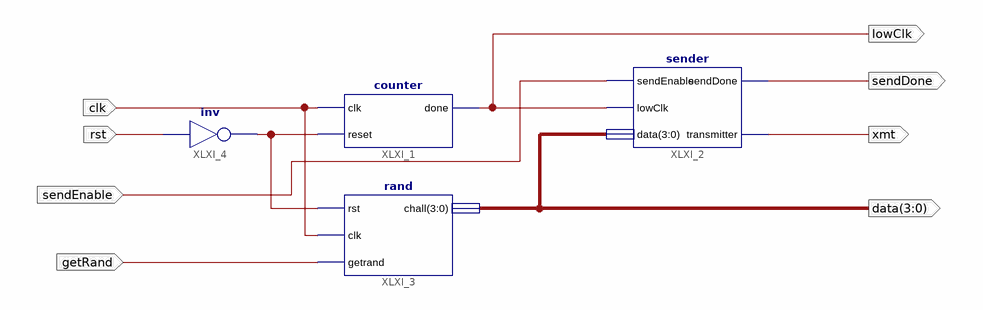
[diagram p0: schematic sheet 1]
// Xilinx ISE schematic top.sch (xc9500xl) as structural Verilog: 4 symbols, 8 ports
module top (
  input  clk,
  input  getRand,
  input  sendEnable,
  input  rst,
  output [3:0] data,
  output xmt,
  output sendDone,
  output lowClk
);

  wire XLXN_20;

  sender XLXI_2 (.sendEnable(sendEnable), .lowClk(lowClk), .data(data), .sendDone(sendDone), .transmitter(xmt));
  counter XLXI_1 (.clk(clk), .reset(XLXN_20), .done(lowClk));
  \rand  XLXI_3 (.rst(XLXN_20), .clk(clk), .getrand(getRand), .chall(data));
  not XLXI_4 (XLXN_20, rst);
endmodule
